# Altium schematic sheet BRD9057A_SiWx917M_4-Layer_ExtSw_REF_DES_A01_Page_2.SchDoc: =TitlePage2
size A3; Organization: Altium Limited; Address1: L3, 12a Rodborough Rd; Address2: Frenchs Forest; Address3: NSW; Address4: Australia 2086; SheetNumber: 2; SheetTotal: 5
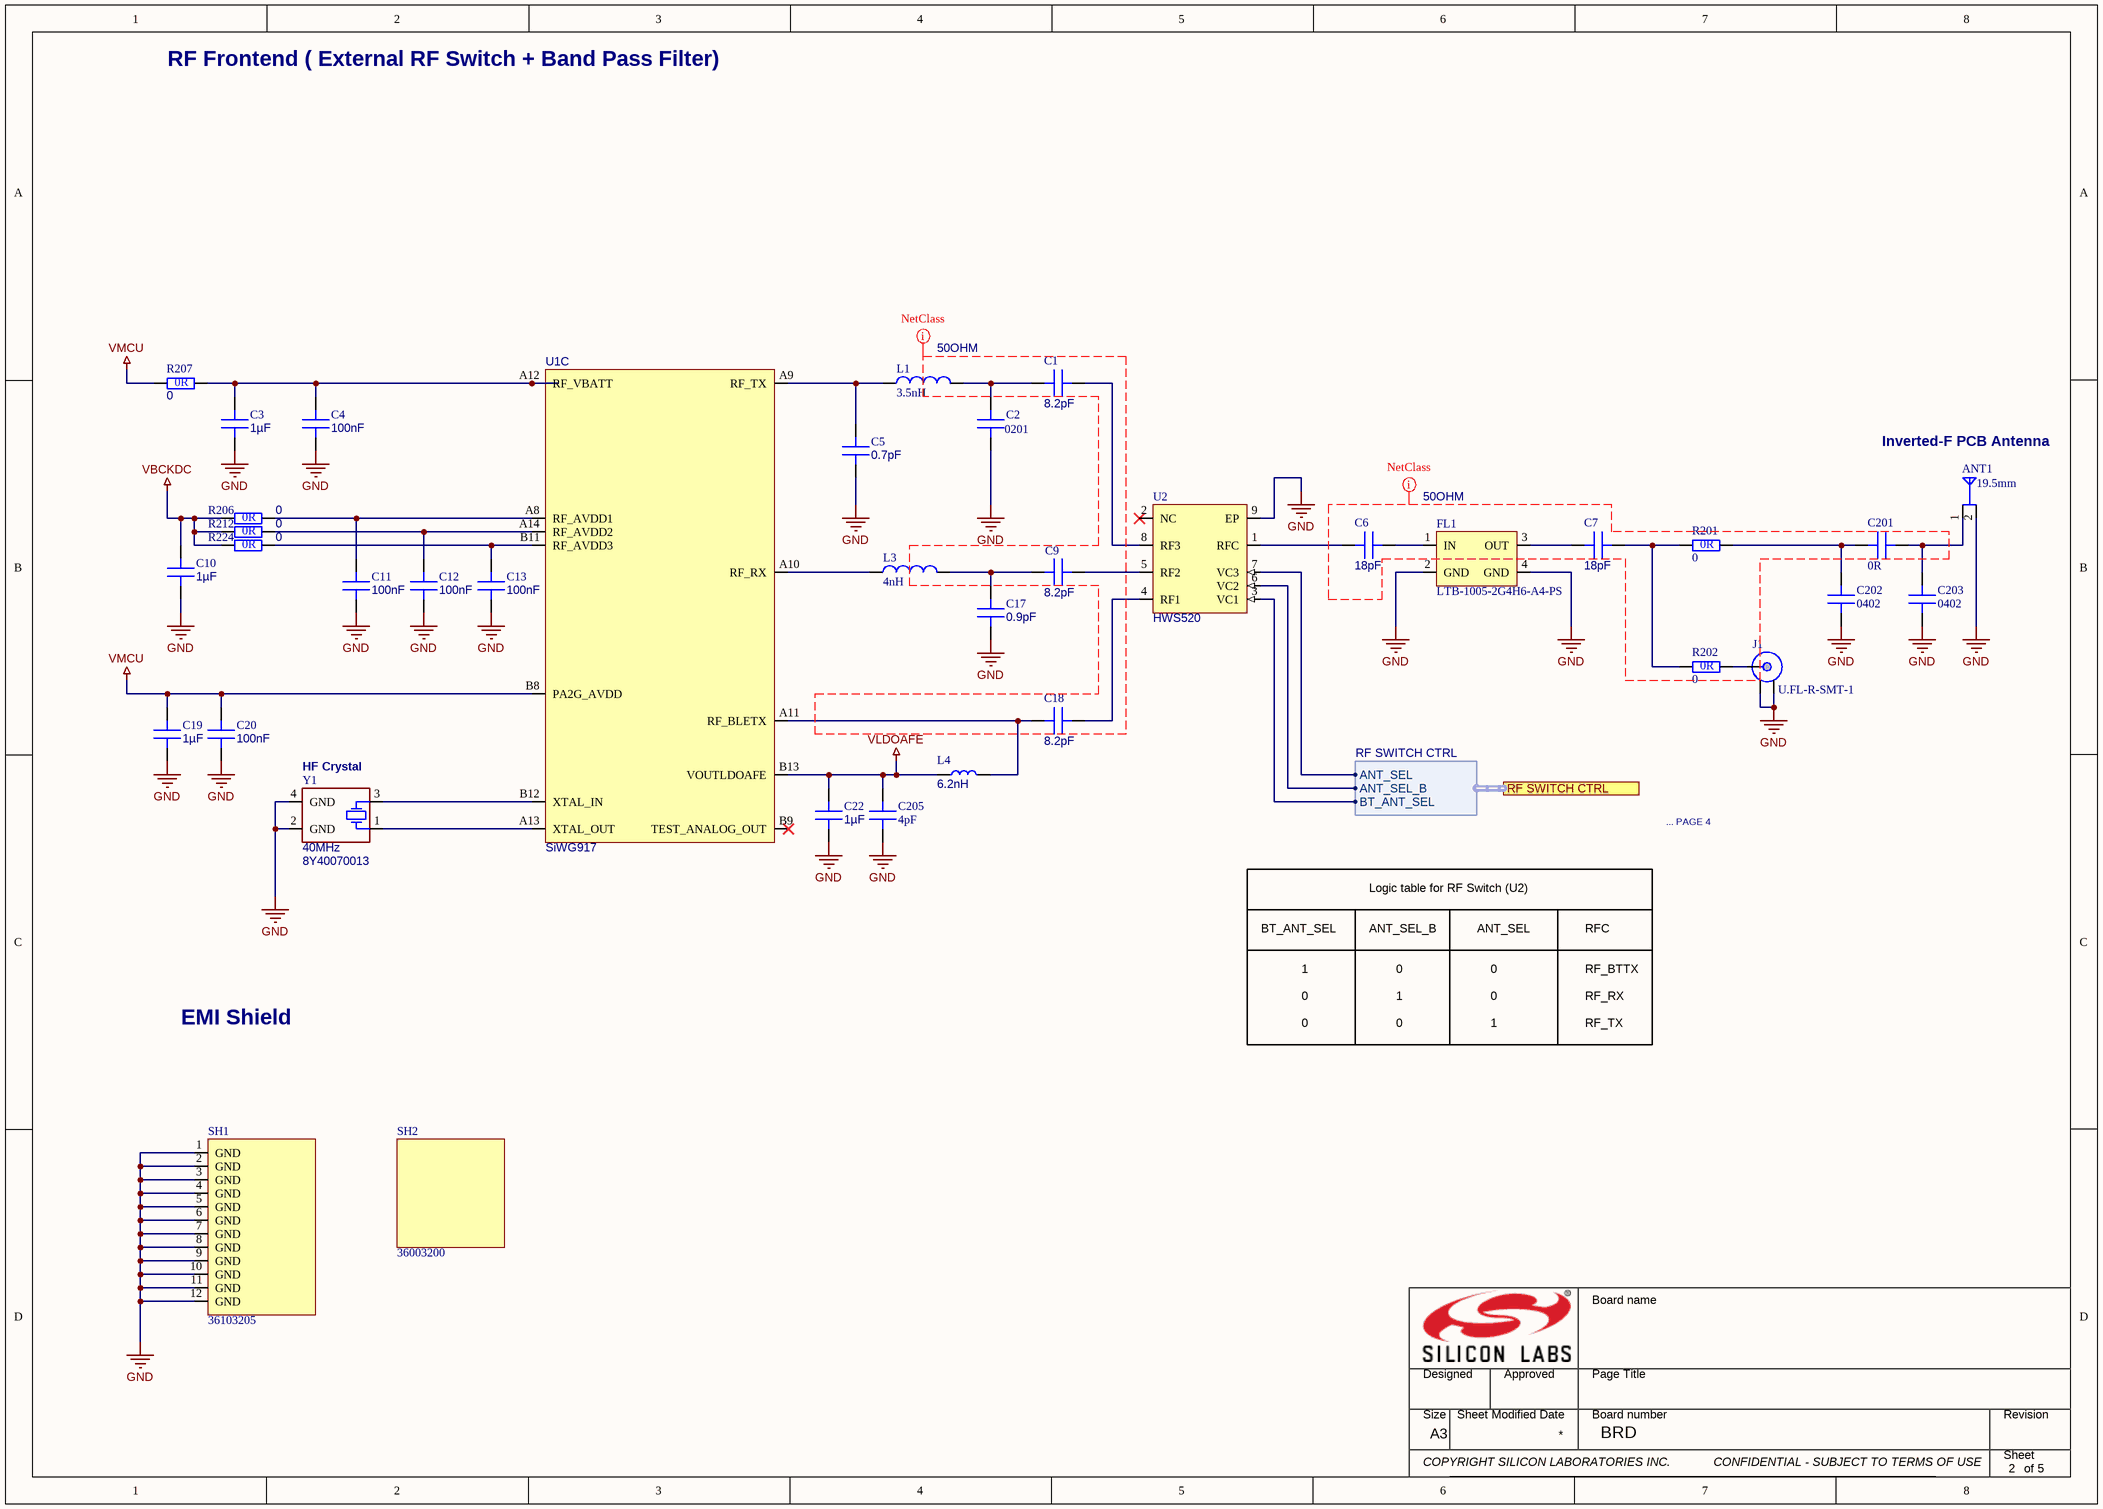
[diagram p0: BRD9057A_SiWx917M_4-Layer_ExtSw_REF_DES_A01_Page_2.SchDoc]

## Parts
ANT1  value 19.5mm  [EM358x_INVERTED_F]  (hidden comment: PATCH ANT INVERTED-F)  (no BOM)
C1  value 8.2pF  [C0201_GM]  (hidden comment: GJM0335C1E8R2BB01)
C2  value 0201  [C0201_GM]  (hidden comment: TBD CAP 0201)  (no BOM)
C3  value 1µF  [C0201_GM]  (hidden comment: CAP CER 0201 X5R 1uF 16V 20%)
C4  value 100nF  [C0201_GM]  (hidden comment: CAP CER 0201 X5R 100nF 16V 10%)
C5  value 0.7pF  [C0201_GM]  (hidden comment: GRM0335C1HR70WA01)
C6  value 18pF  [C0201_GM]  (hidden comment: GRM0335C1H180GA01)
C7  value 18pF  [C0201_GM]  (hidden comment: GRM0335C1H180GA01)
C9  value 8.2pF  [C0201_GM]  (hidden comment: GJM0335C1E8R2BB01)
C10  value 1µF  [C0201_GM]  (hidden comment: CAP CER 0201 X5R 1uF 16V 20%)
C11  value 100nF  [C0201_GM]  (hidden comment: CAP CER 0201 X5R 100nF 16V 10%)
C12  value 100nF  [C0201_GM]  (hidden comment: CAP CER 0201 X5R 100nF 16V 10%)
C13  value 100nF  [C0201_GM]  (hidden comment: CAP CER 0201 X5R 100nF 16V 10%)
C17  value 0.9pF  [C0201_GM]  (hidden comment: GRM0335C1HR90WA01)
C18  value 8.2pF  [C0201_GM]  (hidden comment: GJM0335C1E8R2BB01)
C19  value 1µF  [C0201_GM]  (hidden comment: CAP CER 0201 X5R 1uF 16V 20%)
C20  value 100nF  [C0201_GM]  (hidden comment: CAP CER 0201 X5R 100nF 16V 10%)
C22  value 1µF  [C0201_GM]  (hidden comment: CAP CER 0201 X5R 1uF 16V 20%)
C201  value 0R  [C0402]  (hidden comment: TBD CAP 0402)
C202  value 0402  [C0402]  (hidden comment: TBD CAP 0402)  (no BOM)
C203  value 0402  [C0402]  (hidden comment: TBD CAP 0402)  (no BOM)
C205  value 4pF  [C0201_GM]  (hidden comment: CAP CER 0201 C0G 4pF 25V 0.05pF)
FL1  LTB-1005-2G4H6-A4-PS  [BPF_LTB-1005-2G4H6-A2-PS_GM]
J1  U.FL-R-SMT-1  [KLS1-IPEX_2.6x2.6]
L1  value 3.5nH  [COIL_0201_GM]  (hidden comment: LQP03HQ3N5B02)
L3  value 4nH  [COIL_0201_GM]  (hidden comment: LQP03HQ4N0B02D)
L4  value 6.2nH  [COIL_0201_GM]  (hidden comment: LQP03HQ6N2H02)
R201  value 0  [R0402]  (hidden comment: RES 0402 0R)
R202  value 0  [R0402]  (hidden comment: RES 0402 0R)  (no BOM)
R206  value 0  [R0402]  (hidden comment: RC0402FR-070RL)
R207  value 0  [R0402]  (hidden comment: RC0402FR-070RL)
R212  value 0  [R0402]  (hidden comment: RC0402FR-070RL)
R224  value 0  [R0402]  (hidden comment: RC0402FR-070RL)
SH1  36103205  [WURTH_36103205_No_Paste]  (no BOM)
SH2  36003200  (mechanical)
U1  value SiWG917  [QFN84_SI_SiWx917_A1]  (hidden comment: SiWG917M111MGTBAR)  (part C of 4)
U2  HWS520  [USON8L_1.5X1.5MM_GM]
Y1  value 40MHz  [XTAL200X160X50]  (hidden comment: 8Y40070013)

## Ports
RF SWITCH CTRL (harness RF SWITCH CTRL)

## Harnesses
RF SWITCH CTRL: BT_ANT_SEL, ANT_SEL_B, ANT_SEL

## Nets
GND: ANT1.2 C2.2 C3.1 C4.1 C5.1 C10.1 C11.1 C12.1 C13.1 C17.1 C19.1 C20.1 C22.1 C202.1 C203.1 C205.1 FL1.2(GND) FL1.4(GND) J1.2(SHIELD) J1.3(SHIELD) SH1.1(GND) SH1.2(GND) SH1.3(GND) SH1.4(GND) SH1.5(GND) SH1.6(GND) SH1.7(GND) SH1.8(GND) SH1.9(GND) SH1.10(GND) SH1.11(GND) SH1.12(GND) U2.9(EP) Y1.2(GND) Y1.4(GND)
VBCKDC: C10.2 R206.1 R212.1 R224.1
VLDOAFE: C22.2 C205.2 L4.1 U1.B13(VOUTLDOAFE)
VMCU: C19.2 C20.2 R207.1 U1.B8(PA2G_AVDD)
NetANT1_1: ANT1.1 C201.2 C203.2
NetC1_1: C1.1 C2.1 L1.2
NetC1_2: C1.2 U2.8(RF3)
NetC3_2: C3.2 C4.2 R207.2 U1.A12(RF_VBATT)
NetC5_2: C5.2 L1.1 U1.A9(RF_TX)
NetC6_1: C6.1 U2.1(RFC)
NetC6_2: C6.2 FL1.1(IN)
NetC7_1: C7.1 FL1.3(OUT)
NetC7_2: C7.2 R201.1 R202.1
NetC9_1: C9.1 C17.2 L3.2
NetC9_2: C9.2 U2.5(RF2)
NetC11_2: C11.2 R206.2 U1.A8(RF_AVDD1)
NetC12_2: C12.2 R212.2 U1.A14(RF_AVDD2)
NetC13_2: C13.2 R224.2 U1.B11(RF_AVDD3)
NetC18_1: C18.1 L4.2 U1.A11(RF_BLETX)
NetC18_2: C18.2 U2.4(RF1)
NetC201_1: C201.1 C202.2 R201.2
NetJ1_1: J1.1(CENTER) R202.2
NetL3_1: L3.1 U1.A10(RF_RX)
NetU1_A13: U1.A13(XTAL_OUT) Y1.1(X1)
NetU1_B12: U1.B12(XTAL_IN) Y1.3(X2)
NetU2_3: U2.3(VC1) ; port RF SWITCH CTRL.BT_ANT_SEL
NetU2_6: U2.6(VC2) ; port RF SWITCH CTRL.ANT_SEL_B
NetU2_7: U2.7(VC3) ; port RF SWITCH CTRL.ANT_SEL

Not connected (* = marked no-connect by the designer): U1 B9(TEST_ANALOG_OUT)*; U2 2(NC)*

## Layout directives
net class 50OHM: GND

## Notes on the sheet
- RF Frontend ( External RF Switch + Band Pass Filter)
- Inverted-F PCB Antenna
- (near L3) Text
- (near Y1) HF Crystal
- ... PAGE 4
- Logic table for RF Switch (U2)
- BT_ANT_SEL
- 1
- ANT_SEL_B
- 0
- ANT_SEL
- RFC
- RF_BTTX
- EMI Shield
- RF_RX
- RF_TX
- Board name
- Designed
- Approved
- Page Title
- Size
- A3
- Sheet Modified Date
- Board number
- BRD
- Revision
- Sheet
- COPYRIGHT SILICON LABORATORIES INC.
- CONFIDENTIAL - SUBJECT TO TERMS OF USE
- of
- (in symbol CMP-180-00045-B.02) 0R
- (in symbol CMP-180-00061-B.02) 0R

## Library data of the parts
ANT1 = CMP-000-00029-A.03: ANT PATCH 19.5MM INVERTED-F; Additional Search Tag: Surface; SubCategory Tag: ANT; Mount: N/A
C1 C9 C18 = CMP-120-00147-A.02: CAP CER 0201 C0G 8.2pF 25V ±0.1pF; Manufacturer: Murata; SubCategory Tag: Ceramic; Mount: SMD; Manufacturer PN: GJM0335C1E8R2BB01; Tolerance: 0.1pF; Max Operating Temp: 125°C; Material: C0G; Min Operating Temp: -55°C; Rating: 25V; RoHS: Compliant; Package: 0201
C2 = CMP-000-00022-A.04: Placeholder for 0201 Capacitors; Additional Search Tag: Surface; SubCategory Tag: PLACEHOLDER; Mount: N/A
C3 C10 C19 C22 = CMP-120-00154-A.04: SubCategory Tag: Ceramic; RoHS: Compliant; Rating: 16V; Mount: SMD; Material: X5R; Max Operating Temp: 85°C; Tolerance: 20%; Package: 0201; Min Operating Temp: -55°C
C4 C11-C13 C20 = CMP-120-00007-B.06: SubCategory Tag: Ceramic; Material: X5R; Max Operating Temp: 85°C; Tolerance: 10%; Rating: 16V; Mount: SMD; Package: 0201; RoHS: Compliant; Min Operating Temp: -55°C
C5 = GRM0335C1HR70WA01: CAP CER 0201 C0G 0.7pF 50V ±0.05pF; Manufacturer: Murata; Manufacturer PN: GJM0335C1HR70WB01; Manufacturer Part Number: GJM0335C1HR70WB01D; SubCategory Tag: Ceramic; Rating: 50V; Max Operating Temp: 125°C; Mount: SMD; Min Operating Temp: -55°C; Package: 0201; RoHS: Compliant; Material: C0G; Tolerance: 0.05pF; Component Type: Capacitors
C6 C7 = CMP-120-00183-A.02: CAP CER 0201 C0G 18pF 50V 2%; Manufacturer: Murata; SubCategory Tag: Ceramic; Mount: SMD; Manufacturer PN: GRM0335C1H180GA01; Tolerance: 2%; Max Operating Temp: 125°C; Material: C0G; Min Operating Temp: -55°C; Rating: 50V; RoHS: Compliant; Package: 0201
C17 = GRM0335C1HR90WA01: CAP CER 0201 C0G 0.9pF 50V ±0.05pF; Manufacturer: Murata; Manufacturer PN: GJM0335C1HR70WB01; Manufacturer Part Number: GJM0335C1HR70WB01D; SubCategory Tag: Ceramic; Rating: 50V; Max Operating Temp: 125°C; Mount: SMD; Min Operating Temp: -55°C; Package: 0201; RoHS: Compliant; Material: C0G; Tolerance: 0.05pF; Component Type: Capacitors
C201-C203 = CMP-000-00126-A.01: Placeholder for 0402 Capacitors; Additional Search Tag: Surface; SubCategory Tag: PLACEHOLDER; Mount: N/A
C205 = CMP-120-00019-A.02: SubCategory Tag: Ceramic; Rating: 25V; Min Operating Temp: -55°C; Max Operating Temp: 125°C; Package: 0201; RoHS: Compliant; Material: C0G; Mount: SMD; Tolerance: 0.05pF
FL1 = CMP-143-00003-B.02: FILTER BAND PASS 0402-4Pin 2.45GHz 100MHz; Manufacturer: Maglayers; Package: 0402-4Pin; Value: 2.45GHz; Mount: SMD; RoHS: Compliant; Min Operating Temp: -40°C; SubCategory: Band Pass; Manufacturer PN: LTB-1005-2G4H6-A4-PS; Max Operating Temp: 85°C
J1 = CMP-125-00081-B.01: CONN RF 50OHM UFL_2.6x2.6 SMD; Manufacturer: Hirose; Additional Search Tag: UFL; SubCategory Tag: Other; Mount: SMD; Package: UFL_2.6x2.6; Max Operating Temp: 90°C; Min Operating Temp: -40°C; RoHS: Compliant; Value: U.FL-R-SMT-1; Manufacturer PN: U.FL-R-SMT-1
L1 = CMP-155-00126-A.01: IND Fixed 0201 3.5nH 500mA 170mOhm ±0.1nH; Manufacturer: Murata; DC Resistance: 0.17; Shielding: Not shielded; Manufacturer PN: LQP03HQ3N5B02; Tolerance: 0.1nH; Min Operating Temp: -55°C; Max Operating Temp: 125°C; RoHS: Compliant; Rating: 500mA; Mount: SMD; SubCategory Tag: Fixed; Package: 0201
L3 = LQP03HQ4N0B02D: IND Fixed 0201 4nH 500mA 170mOhm ±0.1nH; Manufacturer PN: LQP03HQ3N5B02; Manufacturer: Murata; Manufacturer Part Number: LQP03HQ3N5B02D; DC Resistance: 0.17; Shielding: Not shielded; Tolerance: 0.1nH; Min Operating Temp: -55°C; Max Operating Temp: 125°C; RoHS: Compliant; Rating: 500mA; Mount: SMD; SubCategory Tag: Fixed; Package: 0201; Component Type: Inductors
L4 = CMP-155-00072-A.04: IND Fixed 0201 6.2nH 400mA 250mOhm 3%; Manufacturer: Murata; Shielding: Not shielded; DC Resistance: 0.25; SubCategory Tag: Fixed; RoHS: Compliant; Mount: SMD; Tolerance: 3%; Package: 0201; Manufacturer PN: LQP03HQ6N2H02; Max Operating Temp: 125°C; Rating: 400mA; Min Operating Temp: -55°C
R201 R202 = CMP-180-00061-B.02: Rating: 62.5mW; SubCategory Tag: Thick Film; Tolerance: 0%; Min Operating Temp: -55°C; Max Operating Temp: 155°C; RoHS: Compliant; Package: 0402; Mount: SMD
R206 R207 R212 R224 = CMP-180-00045-B.02: RES 0402 0R 1/16W 1% 200ppm; Manufacturer: Yageo; Rating: 63mW; SubCategory Tag: Thick Film; Manufacturer PN: RC0402FR-070RL; Tolerance: 1%; Package: 0402; Min Operating Temp: -55°C; Max Operating Temp: 155°C; RoHS: Compliant; Mount: SMD
SH1 = CMP-473-00000-A.08: SHIELD FRAME 21x21x3 STEEL 0.5; Manufacturer: Würth Elektronik; Material: STEEL; Value: 21x21x3; Max Operating Temp: 125°C; SubCategory Tag: FRAME; Mount: SMD; Min Operating Temp: -40°C; RoHS: Compliant; Manufacturer PN: 36103205
SH2 = CMP-473-00001-A.04: SHIELD COVER 21.8x21.8x3 STEEL 0.3; Manufacturer: Würth Elektronik; RoHS: Compliant; SubCategory Tag: COVER; Max Operating Temp: 125°C; Value: 21.8x21.8x3; Min Operating Temp: -40°C; Manufacturer PN: 36003200; Mount: SMD; Material: STEEL
U1 = CMP-150-00167-C.02: IC SoC 32BIT 8MB FLASH QFN84 2.4GHz Single Band Wi-Fi; Manufacturer: Silicon Labs; Additional Search Tag: SoC Wireless; SubCategory Tag: Embedded; Voltage: 3.63V; Min Operating Temp: -40°C; Max Operating Temp: 85°C; Manufacturer PN: SiWG917M111MGTBAR; RoHS: Compliant; Mount: SMD; Package: QFN84
U2 = CMP-150-00062-B.04: IC RF SWITCH SP3T 6GHz USON8L; Manufacturer: Hexawave; Additional Search Tag: RF Switches; SubCategory Tag: Interface; Voltage: 6V; Note: Alternate footprint has bottom SM opening as per request; Mount: SMD; Package: 8-USON; Manufacturer PN: HWS520; Max Operating Temp: 85°C; Value: HWS520; RoHS: Compliant; Min Operating Temp: -40°C
Y1 = CMP-130-00017-A.04: CRYSTAL 2.0X1.6mm 40MHz 8pF 8ppm; Manufacturer: TXC; SubCategory Tag: XTAL; Mount: SMD; Manufacturer PN: 8Y40070013; Package: 2.0X1.6mm; Max Operating Temp: 105°C; Tolerance: 8ppm; RoHS: Compliant; Min Operating Temp: -40°C